# Altium schematic sheet IndAlarmSe1.SchDoc
size A4
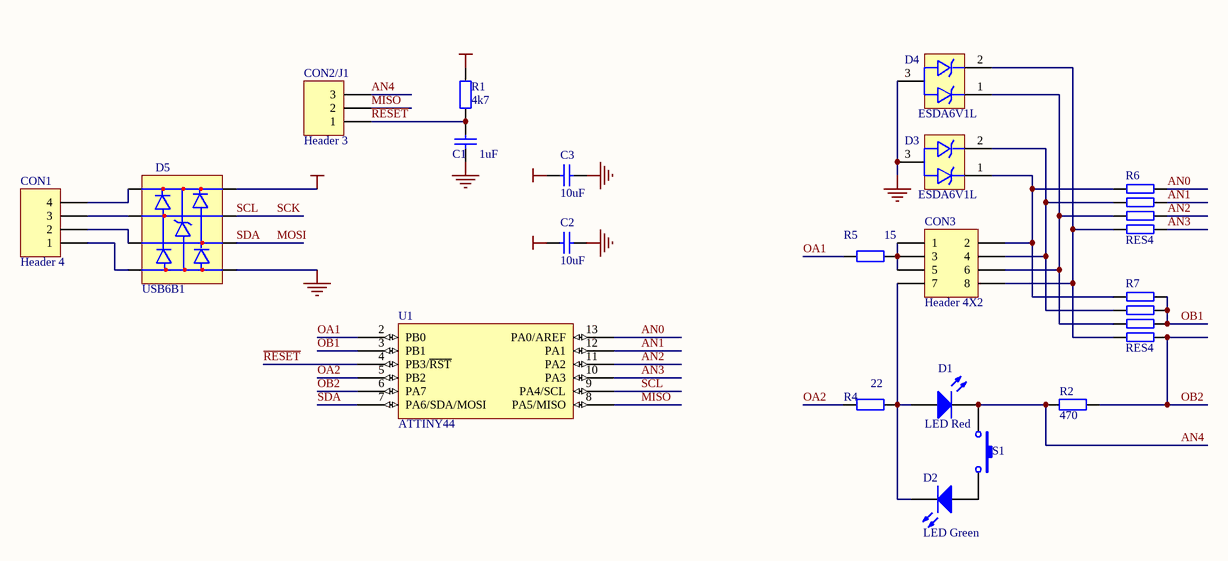
[diagram p0: IndAlarmSe1.SchDoc]

## Parts
C1  value 1uF  [CC1608-0603]  (hidden comment: Cap Semi)
C2  value 10uF  [CC3216-1206]  (hidden comment: Cap Semi)
C3  value 10uF  [CC3216-1206]  (hidden comment: Cap Semi)
CON1  Header 4  [4MM2]
CON2/J1  Header 3  [3MM2L]
CON3  Header 4X2  [4X2MM2]
D1  LED Red  [LED3MM]
D2  LED Green  [LED3MM]
D3  ESDA6V1L  [SO-G3/C2.5]
D4  ESDA6V1L  [SO-G3/C2.5]
D5  USB6B1  [NSO8]
R1  value 4k7  [CR1608-0603]  (hidden comment: Res Semi)
R2  value 470  [CR1608-0603]  (hidden comment: Res Semi)
R4  value 22  [CR1608-0603]  (hidden comment: Res Semi)
R5  value 15  [CR1608-0603]  (hidden comment: Res Semi)
R6  RES4  [YC164]
R7  RES4  [YC164]
S1  SW-PB  [SPPB512300]  (value not drawn)
U1  ATTINY44  [SO-G14]

## Nets
GND: C1.1 C2.1 C3.1 D3.3 D4.3 D5.5(GND) U1.14(GND)
VCC: C2.2 C3.2 D5.8(VCC) R1.1 U1.1(VCC)
AN0: R6.8 U1.13(PA0/AREF)
AN1: R6.7 U1.12(PA1)
AN2: R6.6 U1.11(PA2)
AN3: R6.5 U1.10(PA3)
AN4: CON2/J1.3 D1.2(K) R2.2 S1.1
MISO: CON2/J1.2 U1.8(PA5/MISO)
MOSI: D5.6(I/O2) U1.7(PA6/SDA/MOSI)  [also labelled SDA]
OA1: R5.1 U1.2(PB0)
OA2: R4.1 U1.5(PB2)
OB1: R7.6 R7.7 R7.8 U1.3(PB1)
OB2: R2.1 R7.5 U1.6(PA7)
~{RESET}: C1.2 CON2/J1.1 R1.2 U1.4(PB3/~{RST})
SCK: D5.7(I/O1) U1.9(PA4/SCL)  [also labelled SCL]
NetCON1_1: CON1.1 D5.4(GND)
NetCON1_2: CON1.2 D5.3(I/O2)
NetCON1_3: CON1.3 D5.2(I/O1)
NetCON1_4: CON1.4 D5.1(VCC)
NetCON3_1: CON3.1 CON3.3 CON3.5 R5.2
NetCON3_2: CON3.2 D3.1 R6.1 R7.1
NetCON3_4: CON3.4 D3.2 R6.2 R7.2
NetCON3_6: CON3.6 D4.1 R6.3 R7.3
NetCON3_7: CON3.7 D1.1(A) D2.2(K) R4.2
NetCON3_8: CON3.8 D4.2 R6.4 R7.4
NetD2_1: D2.1(A) S1.2

## Library data of the parts
C1-C3 = Cap Semi: Capacitor (Semiconductor SIM Model); Published: 8-Jun-2000; Revision: July-2002: Re-released for DXP Platform.; Publisher: Altium Limited
CON1 = Header 4: Header, 4-Pin; Revision: 17-Jul-2002: Re-released for DXP Platform.; Publisher: Altium Limited
CON2/J1 = Header 3: Header, 3-Pin; Revision: 17-Jul-2002: Re-released for DXP Platform.; Publisher: Altium Limited
CON3 = Header 4X2: Header, 4-Pin, Dual row; Revision: 17-Jul-2002: Re-released for DXP Platform.; Publisher: Altium Limited
D1 = LED3: Typical BLUE SiC LED; Revision 1: Jul-2002: Re-released for DXP Platform.; Revision 2: 17-Dec-2003: PCB Footprint replaced.; Code: FA-190UHR; Published: 8-Jun-2000; Publisher: Altium Limited
D2 = LED3: Typical BLUE SiC LED; Revision 1: Jul-2002: Re-released for DXP Platform.; Revision 2: 17-Dec-2003: PCB Footprint replaced.; Code: FA-190UYG; Published: 8-Jun-2000; Publisher: Altium Limited
D3 D4 = ESDA6V1L: DUAL TRANSIL ARRAY / FOR ESD PROTECTION
R1 R2 R4 R5 = Res Semi: Semiconductor Resistor; Published: 8-Jun-2000; Revision: July-2002: Re-released for DXP Platform.; Publisher: Altium Limited
S1 = SW-PB: Switch; Published: 24-Mar-1999; Revision: July-2002: Re-released for DXP Platform.; Publisher: Altium Limited